# Altium project Arduino开发板 MINI款.PrjPcb
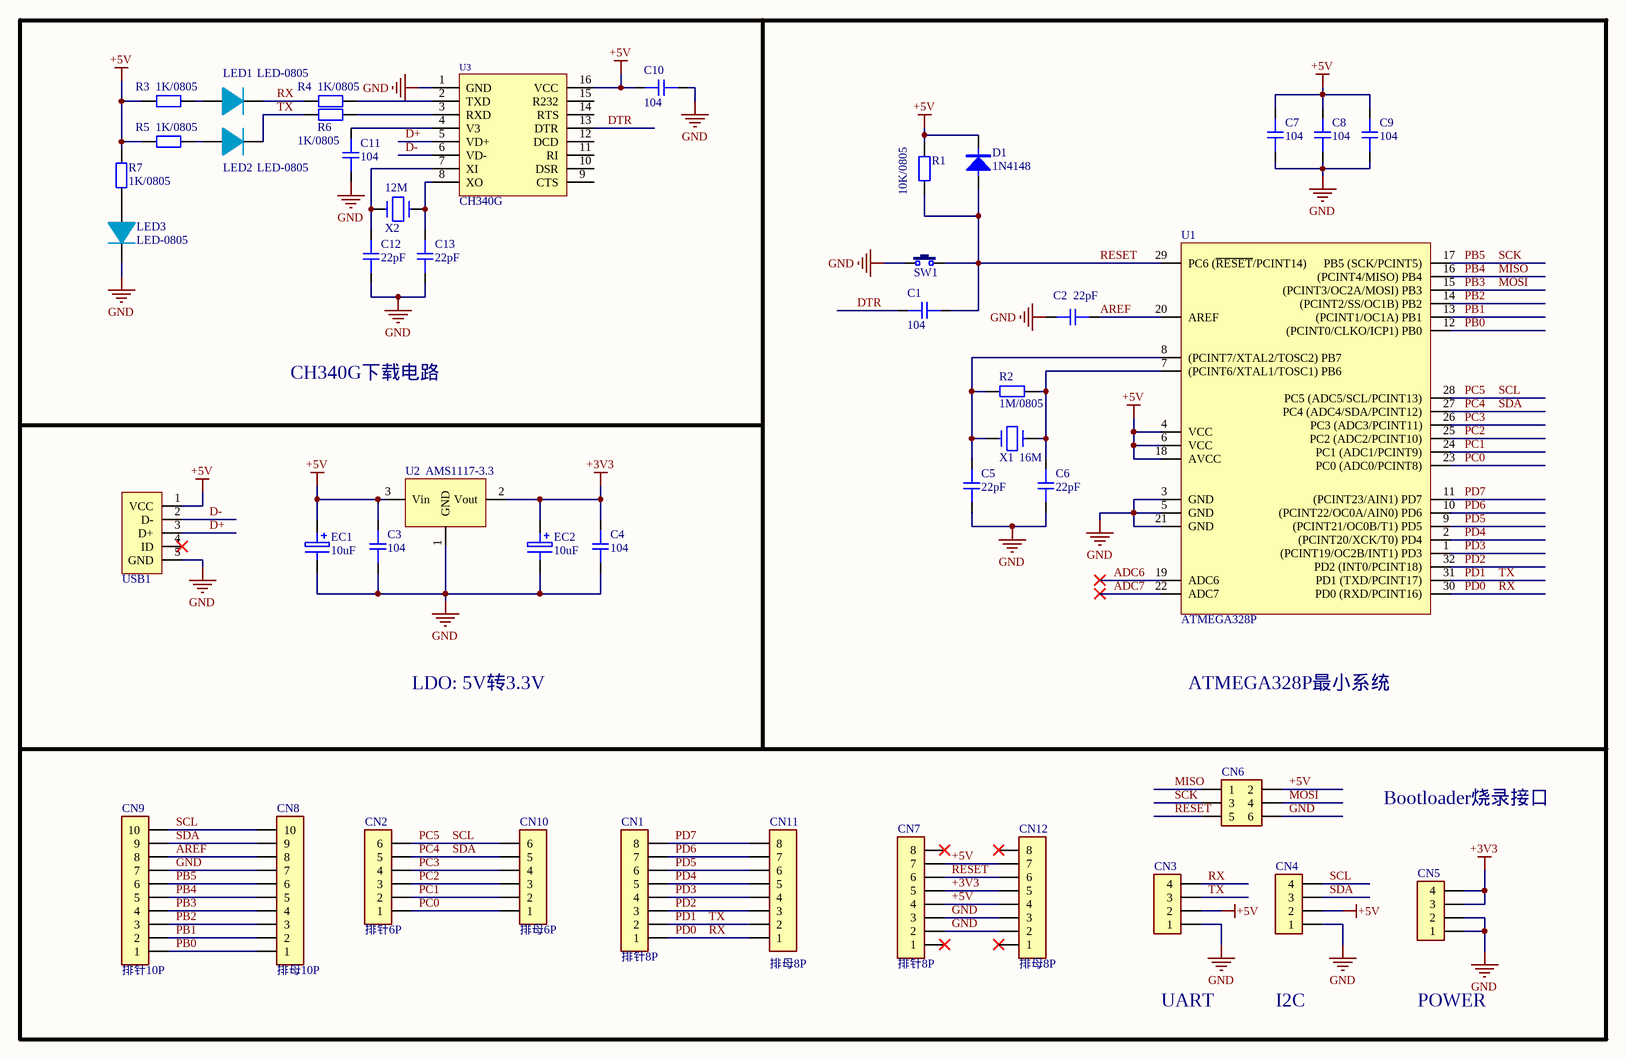
[diagram p0: Arduino开发板 MINI款.SchDoc]
1 sheet, 45 parts. Net scope: global (net labels, ports and power ports of the same name join across sheets).
Board file: Arduino开发板 MINI款.PcbDoc

## Sheet Arduino开发板 MINI款.SchDoc
size A3

### Parts
C1  104  [C0805-SMT]
C2  22pF  [C0805-SMT]
C3  104  [C0805-SMT]
C4  104  [C0805-SMT]
C5  22pF  [C0805-SMT]
C6  22pF  [C0805-SMT]
C7  104  [C0805-SMT]
C8  104  [C0805-SMT]
C9  104  [C0805-SMT]
C10  104  [C0805-SMT]
C11  104  [C0805-SMT]
C12  22pF  [C0805-SMT]
C13  22pF  [C0805-SMT]
CN1  排针8P  [sip8]
CN2  排针6P  [sip6]
CN3  CN4  [sip4]  (value not drawn)
CN4  CN4  [sip4]  (value not drawn)
CN5  CN4  [sip4]  (value not drawn)
CN6  CN2*3  [sip2*3]  (value not drawn)
CN7  排针8P  [SIP8]
CN8  排母10P  [HDR2.54-M-LI-10P]
CN9  排针10P  [SIP10]
CN10  排母6P  [HDR2.54-M-LI-6P]
CN11  排母8P  [HDR2.54-M-LI-8P]
CN12  排母8P  [HDR2.54-M-LI-8P]
D1  1N4148  [SOD123/F(4148)-SMT]
EC1  10uF  [CAE2.54-Φ5-AI]
EC2  10uF  [CAE2.54-Φ5-AI]
LED1  LED-0805  [LED 0805R]
LED2  LED-0805  [LED 0805R]
LED3  LED-0805  [LED 0805R]
R1  10K/0805  [R0805-SMT]
R2  1M/0805  [R0805-SMT]
R3  1K/0805  [R0805-SMT]
R4  1K/0805  [R0805-SMT]
R5  1K/0805  [R0805-SMT]
R6  1K/0805  [R0805-SMT]
R7  1K/0805  [R0805-SMT]
SW1  6_6_5MM轻触按键  [TSW SMD-6*6*5]  (value not drawn)
U1  ATMEGA328P  [LQFP32 7X7_M]
U2  AMS1117-3.3  [SOT-223]
U3  CH340G  [IC-SOP16-1.27-SMT]
USB1  USB-5P  [USB-MICRO_D]  (value not drawn)
X1  16M  [OSC HC-49S]
X2  12M  [OSC HC-49S]

### Nets
+3V3: C4.2 CN5.3 CN5.4 CN7.5 CN12.5 EC2.1 U2.2(Vout)
+5V: C3.2 C7.2 C8.2 C9.2 C10.1 CN3.2 CN4.2 CN6.2 CN7.4 CN7.7 CN12.4 CN12.7 D1.K EC1.1 R1.2 R3.1 R5.1 R7.2 U1.4(VCC) U1.6(VCC) U1.18(AVCC) U2.3(Vin) U3.16(VCC) USB1.1(VCC)
GND: C2.2 C3.1 C4.1 C5.1 C6.1 C7.1 C8.1 C9.1 C10.2 C11.1 C12.1 C13.1 CN3.1 CN4.1 CN5.1 CN5.2 CN6.6 CN7.2 CN7.3 CN8.7 CN9.7 CN12.2 CN12.3 EC1.2 EC2.2 LED3.1 SW1.1 U1.3(GND) U1.5(GND) U1.21(GND) U2.1(GND) U3.1(GND) USB1.5(GND)
ADC6: U1.19(ADC6)
ADC7: U1.22(ADC7)
AREF: C2.1 CN8.8 CN9.8 U1.20(AREF)
D+: U3.5(VD+) USB1.3(D+)
D-: U3.6(VD-) USB1.2(D-)
DTR: C1.1 U3.13(DTR)
MISO: CN6.1 CN8.5 CN9.5 U1.16((PCINT4/MISO)_PB4)  [also labelled PB4]
MOSI: CN6.4 CN8.4 CN9.4 U1.15((PCINT3/OC2A/MOSI)_PB3)  [also labelled PB3]
PB0: CN8.1 CN9.1 U1.12((PCINT0/CLKO/ICP1)_PB0)
PB1: CN8.2 CN9.2 U1.13((PCINT1/OC1A)_PB1)
PB2: CN8.3 CN9.3 U1.14((PCINT2/SS/OC1B)_PB2)
PB5: CN6.3 CN8.6 CN9.6 U1.17(PB5_(SCK/PCINT5))  [also labelled SCK]
PC0: CN2.1 CN10.1 U1.23(PC0_(ADC0/PCINT8))
PC1: CN2.2 CN10.2 U1.24(PC1_(ADC1/PCINT9))
PC2: CN2.3 CN10.3 U1.25(PC2_(ADC2/PCINT10))
PC3: CN2.4 CN10.4 U1.26(PC3_(ADC3/PCINT11))
PC4: CN2.5 CN4.3 CN8.9 CN9.9 CN10.5 U1.27(PC4_(ADC4/SDA/PCINT12))  [also labelled SDA]
PC5: CN2.6 CN4.4 CN8.10 CN9.10 CN10.6 U1.28(PC5_(ADC5/SCL/PCINT13))  [also labelled SCL]
PD0: CN1.1 CN3.4 CN11.1 LED1.1 R4.1 U1.30(PD0_(RXD/PCINT16))  [also labelled RX]
PD1: CN1.2 CN3.3 CN11.2 LED2.1 R6.1 U1.31(PD1_(TXD/PCINT17))  [also labelled TX]
PD2: CN1.3 CN11.3 U1.32(PD2_(INT0/PCINT18))
PD3: CN1.4 CN11.4 U1.1((PCINT19/OC2B/INT1)_PD3)
PD4: CN1.5 CN11.5 U1.2((PCINT20/XCK/T0)_PD4)
PD5: CN1.6 CN11.6 U1.9((PCINT21/OC0B/T1)_PD5)
PD6: CN1.7 CN11.7 U1.10((PCINT22/OC0A/AIN0)_PD6)
PD7: CN1.8 CN11.8 U1.11((PCINT23/AIN1)_PD7)
RESET: C1.2 CN6.5 CN7.6 CN12.6 D1.A R1.1 SW1.3 U1.29(PC6_(~{RESET}/PCINT14))
NetC5_2: C5.2 R2.2 U1.8((PCINT7/XTAL2/TOSC2)_PB7) X1.1
NetC6_2: C6.2 R2.1 U1.7((PCINT6/XTAL1/TOSC1)_PB6) X1.2
NetC11_2: C11.2 U3.4(V3)
NetC12_2: C12.2 U3.7(XI) X2.1
NetC13_2: C13.2 U3.8(XO) X2.2
NetLED1_2: LED1.2 R3.2
NetLED2_2: LED2.2 R5.2
NetLED3_2: LED3.2 R7.1
NetR4_2: R4.2 U3.2(TXD)
NetR6_2: R6.2 U3.3(RXD)

Not connected (* = marked no-connect by the designer): CN7 1* 8*; CN12 1* 8*; U3 9(CTS) 10(DSR) 11(RI) 12(DCD) 14(RTS) 15(R232); USB1 4(ID)*

### Notes on the sheet
- CH340G下载电路
- LDO: 5V转3.3V
- ATMEGA328P最小系统
- Bootloader烧录接口
- UART
- I2C
- POWER

### Library data of the parts
C1-C13 = C
CN1 CN7 CN11 CN12 = CN8: 8P-SOCKET
CN2 CN10 = CN6: 6P-SOCKET
CN3-CN5 = CN4: 4P-SOCKET
CN8 CN9 = CN10: 10P-SOCKET
D1 = D: DIODE
EC1 EC2 = CAE: EA
LED1-LED3 = LED-0805: LED_0805
R1-R7 = R: RES
X1 X2 = X: 4M